# Altium schematic sheet Bluetooth_mersasV2.SchDoc
size A2
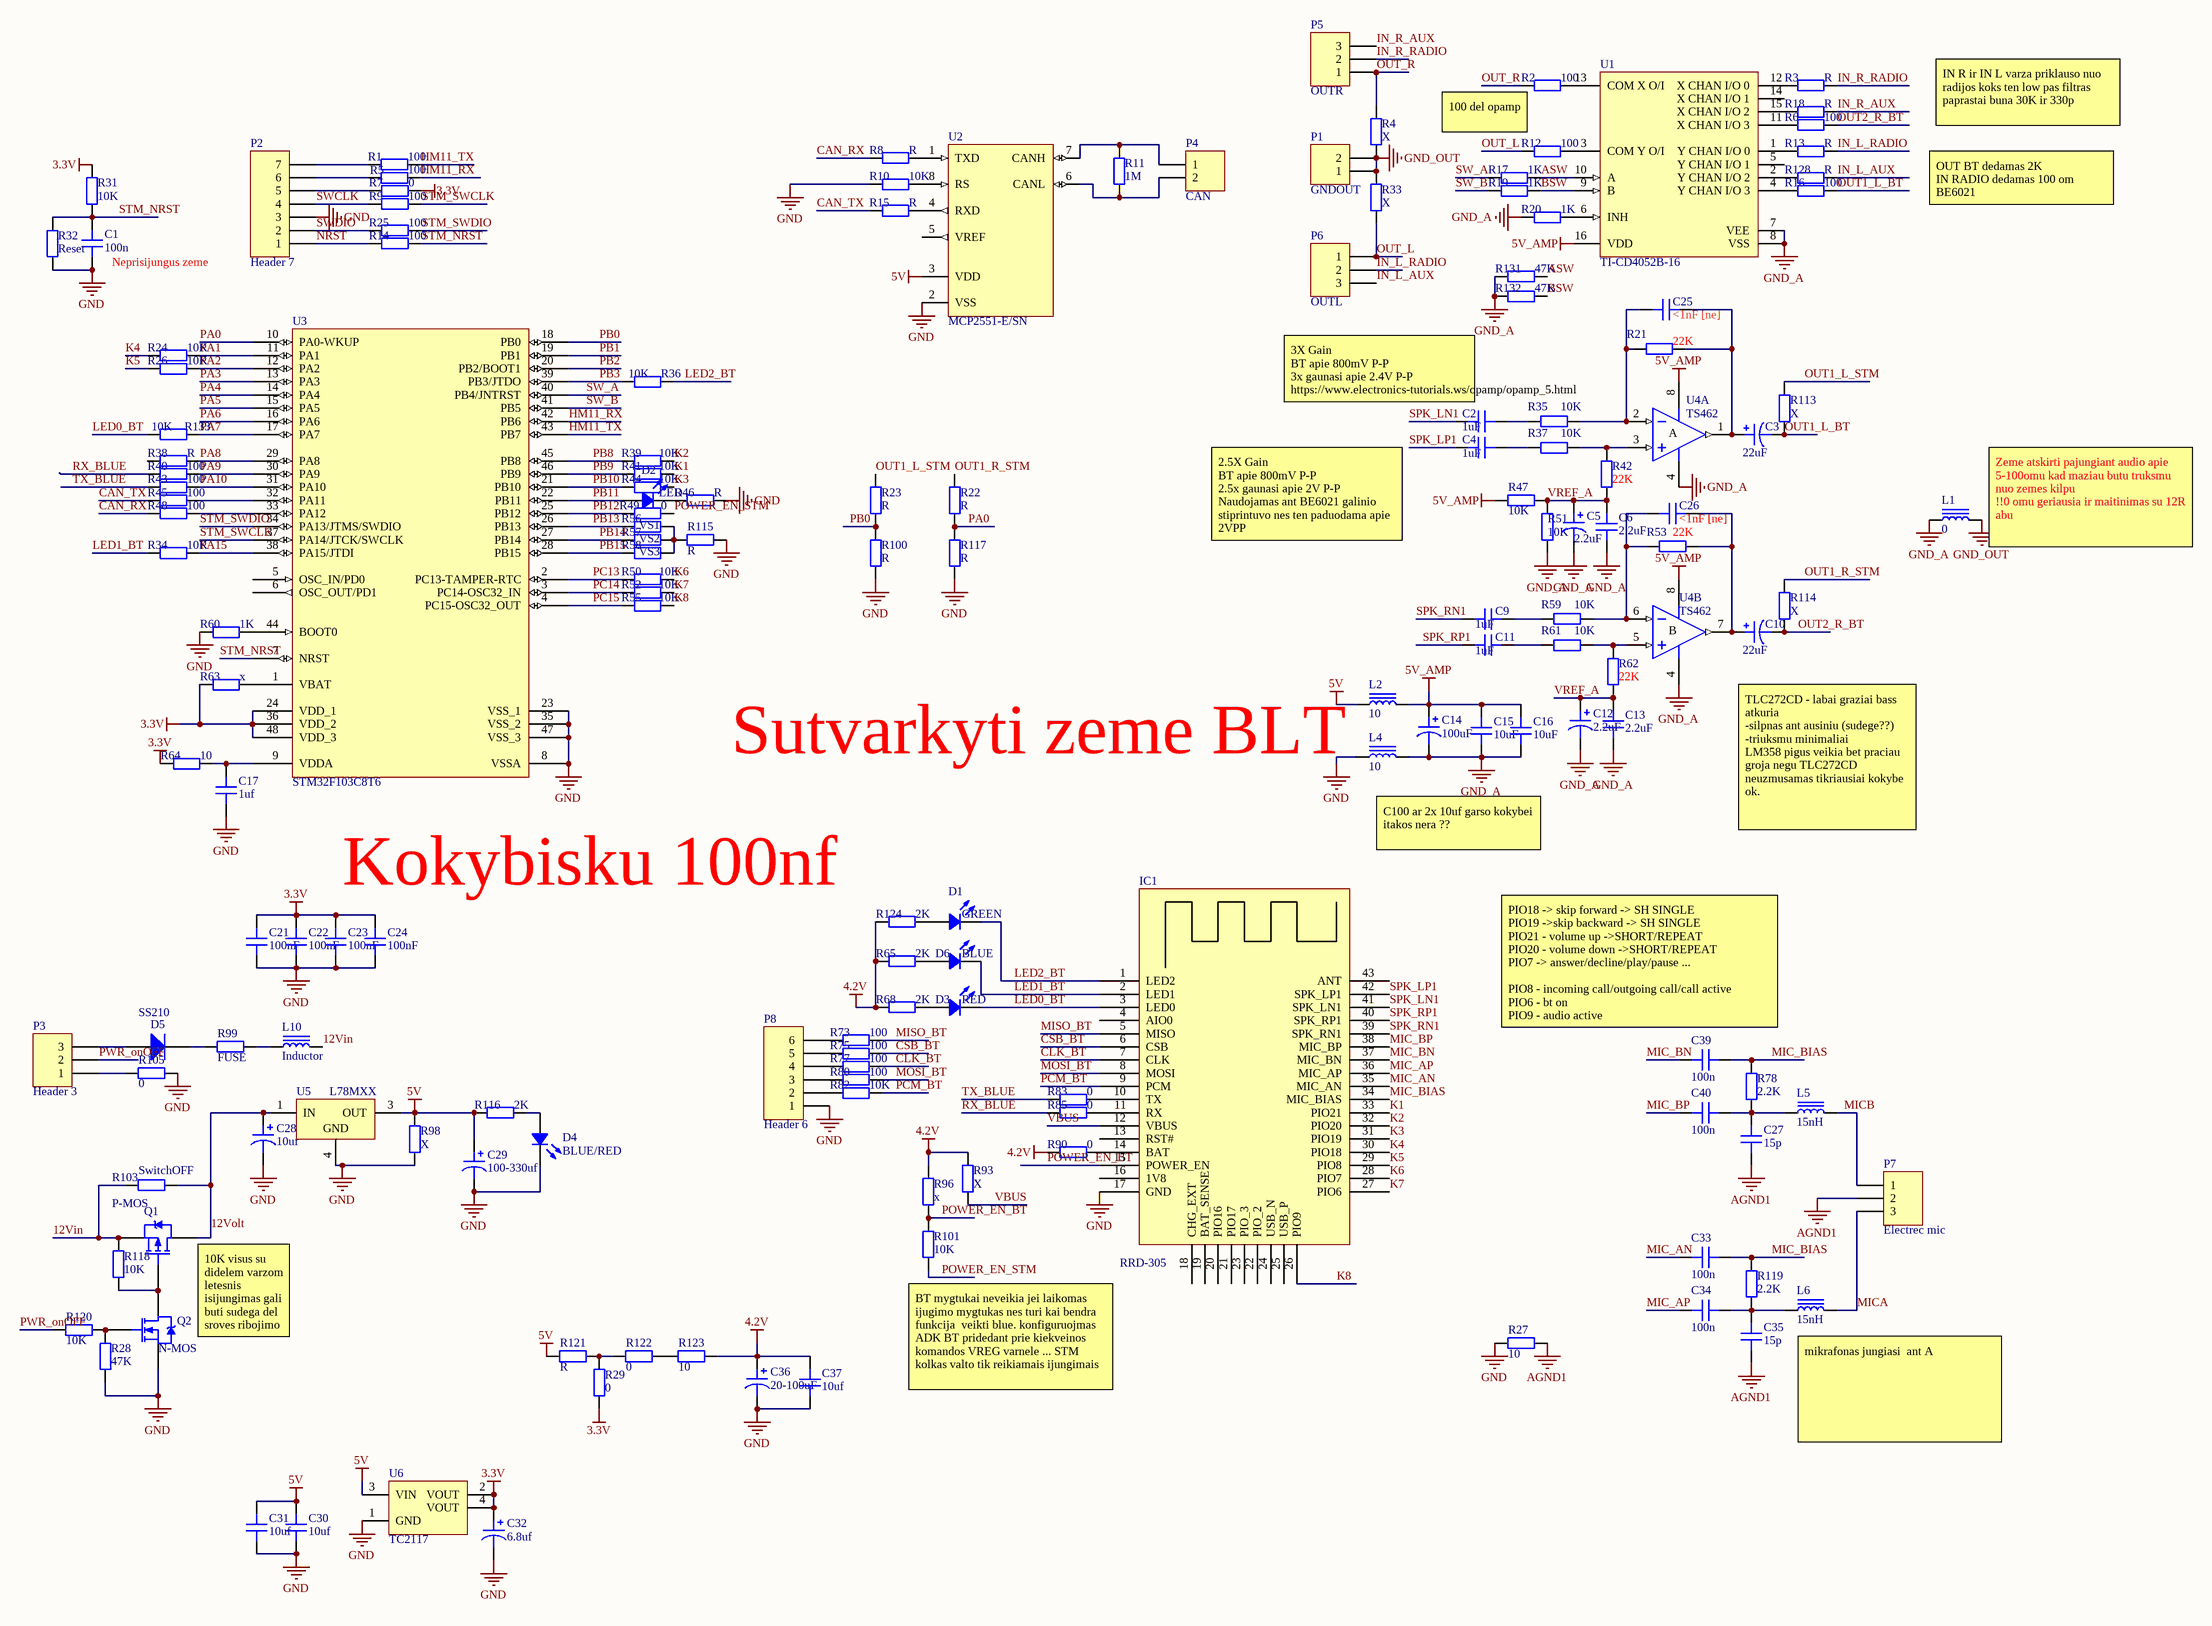
[diagram p0: Bluetooth_mersasV2.SchDoc]

## Parts
C1  100n  [CAP 0603/1608]
C2  1uF  [CAP 0805/2012]
C3  22uF  [TANT A size]
C4  1uF  [CAP 0805/2012]
C5  2.2uF  [TANT R(2824)]
C6  2.2uF  [CAP 0805/2012]
C9  1uF  [CAP 0805/2012]
C10  22uF  [TANT A size]
C11  1uF  [CAP 0805/2012]
C12  2.2uF  [TANT R(2824)]
C13  2.2uF  [CAP 0805/2012]
C14  100uF  [tant B size]
C15  10uF  [CAP 1206/3216]
C16  10uF  [CAP 1206/3216]
C17  1uf  [CAP 0805/2012]
C21  100nF  [CAP 0603/1608]
C22  100nF  [CAP 0603/1608]
C23  100nF  [CAP 0603/1608]
C24  100nF  [CAP 0603/1608]
C25  <1nF [ne]  [CAP 0805/2012]
C26  <1nF [ne]  [CAP 0805/2012]
C27  15p  [CAP 0603/1608]
C28  10uf  [CAP POL 2917/7343]
C29  100-330uf  [CAP POL 2917/7343]
C30  10uf  [CAP 1210/3225]
C31  10uf  [CAP 1210/3225]
C32  6.8uf  [CAP POL 2917/7343]
C33  100n  [CAP 0603/1608]
C34  100n  [CAP 0603/1608]
C35  15p  [CAP 0603/1608]
C36  20-100uF  [tant B size]
C37  10uf  [CAP 1206/3216]
C39  100n  [CAP 0603/1608]
C40  100n  [CAP 0603/1608]
D1  GREEN  [LED 0805/2012]
D2  LED  [LED 0603/1608]
D3  RED  [LED 0805/2012]
D4  BLUE/RED  [LED 0805/2012]
D5  SS210  [DO214AC SMA]
D6  BLUE  [LED 0805/2012]
IC1  RRD-305  [RRD-305]
L1  0  [IND 1206/3216 - 1.0MM]
L2  10  [IND 1206/3216 - 1.0MM]
L4  10  [IND 1206/3216 - 1.0MM]
L5  15nH  [IND 1206/3216 - 1.0MM]
L6  15nH  [IND 1206/3216 - 1.0MM]
L10  Inductor  [IND 1206/3216 - 1.0MM]
P1  GNDOUT  [HDR1X2]
P2  Header 7  [2mm1X7]
P3  Header 3  [HDR1X3]
P4  CAN  [HDR1X2]
P5  OUTR  [HDR1X3]
P6  OUTL  [HDR1X3]
P7  Electrec mic  [HDR1X3]
P8  Header 6  [2mm1X6]
Q1  P-MOS  [TI SOT-23-3 DBZ]
Q2  N-MOS  [TI SOT-23-3 DBZ]
R1  100  [RES 0603/1608]
R2  100  [RES 0805/2012]
R3  R  [RES 0805/2012]
R4  X  [RES 0805/2012]
R5  100  [RES 0603/1608]
R6  100  [RES 0805/2012]
R7  0  [RES 0603/1608]
R8  R  [RES 0805/2012]
R9  100  [RES 0603/1608]
R10  10K  [RES 0805/2012]
R11  1M  [RES 0603/1608]
R12  100  [RES 0805/2012]
R13  R  [RES 0805/2012]
R14  100  [RES 0603/1608]
R15  R  [RES 0603/1608]
R16  100  [RES 0805/2012]
R17  1K  [RES 0603/1608]
R18  R  [RES 0805/2012]
R19  1K  [RES 0603/1608]
R20  1K  [RES 0603/1608]
R21  22K  [RES 0805/2012]
R22  R  [RES 0603/1608]
R23  R  [RES 0603/1608]
R24  10K  [RES 0603/1608]
R25  100  [RES 0805/2012]
R26  10K  [RES 0603/1608]
R27  10  [RES 0805/2012]
R28  47K  [RES 0603/1608]
R29  0  [RES 1206/3216]
R31  10K  [RES 0603/1608]
R32  Reset  [RES 0805/2012]
R33  X  [RES 0805/2012]
R34  10K  [RES 0603/1608]
R35  10K  [RES 0805/2012]
R36  10K  [RES 0603/1608]
R37  10K  [RES 0805/2012]
R38  R  [RES 0603/1608]
R39  10K  [RES 0603/1608]
R40  100  [RES 0603/1608]
R41  10K  [RES 0603/1608]
R42  22K  [RES 0805/2012]
R43  100  [RES 0603/1608]
R44  10K  [RES 0603/1608]
R45  100  [RES 0603/1608]
R46  R  [RES 0603/1608]
R47  10K  [RES 0805/2012]
R48  100  [RES 0603/1608]
R49  0  [RES 0603/1608]
R50  10K  [RES 0603/1608]
R51  10K  [RES 0805/2012]
R52  10K  [RES 0603/1608]
R53  22K  [RES 0805/2012]
R55  10K  [RES 0603/1608]
R56  VS1  [RES 0603/1608]
R57  VS2  [RES 0603/1608]
R58  VS3  [RES 0603/1608]
R59  10K  [RES 0805/2012]
R60  1K  [RES 0603/1608]
R61  10K  [RES 0805/2012]
R62  22K  [RES 0805/2012]
R63  x  [RES 0603/1608]
R64  10  [RES 1206/3216]
R65  2K  [RES 0805/2012]
R68  2K  [RES 0805/2012]
R73  100  [RES 0603/1608]
R75  100  [RES 0603/1608]
R77  100  [RES 0603/1608]
R78  2.2K  [RES 0805/2012]
R80  100  [RES 0603/1608]
R82  10K  [RES 0603/1608]
R83  0  [RES 0603/1608]
R85  0  [RES 0603/1608]
R90  0  [RES 0603/1608]
R93  X  [RES 0603/1608]
R96  x  [RES 0603/1608]
R98  X  [RES 1206/3216]
R99  FUSE  [RES 1206/3216]
R100  R  [RES 0603/1608]
R101  10K  [RES 0603/1608]
R103  SwitchOFF  [RES 0805/2012]
R105  0  [RES 1206/3216]
R113  X  [RES 0603/1608]
R114  X  [RES 0603/1608]
R115  R  [RES 0603/1608]
R116  2K  [RES 0805/2012]
R117  R  [RES 0603/1608]
R118  10K  [RES 0603/1608]
R119  2.2K  [RES 0805/2012]
R120  10K  [RES 0805/2012]
R121  R  [RES 1206/3216]
R122  0  [RES 1206/3216]
R123  10  [RES 1206/3216]
R124  2K  [RES 0805/2012]
R128  R  [RES 0805/2012]
R131  47K  [RES 0603/1608]
R132  47K  [RES 0603/1608]
R133  10K  [RES 0603/1608]
U1  TI-CD4052B-16  [D0016A_N]
U2  MCP2551-E/SN  [SOIC-SN8_L]
U3  STM32F103C8T6  [NXP LQFP-48 7x7mm]
U4  TS462  [DIODES SO-8]  (parts A,B of 2)
U5  L78MXX  [TO-252]
U6  TC2117  [ST SOT-223]

## Nets
3.3V: C21.2 C22.2 C23.2 C24.2 C32.1 R7.1 R29.2 R31.2 R63.2 R64.2 U3.24(VDD_1) U3.36(VDD_2) U3.48(VDD_3) U6.2(VOUT) U6.4(VOUT)
4.2V: C36.1 C37.2 R65.2 R68.2 R90.2 R93.2 R96.1 R123.2 R124.2
5V: C29.1 C30.2 C31.2 L2.1 R98.1 R116.2 R121.1 U2.3(VDD) U5.3(OUT) U6.3(VIN)
5V_AMP: C14.1 C15.2 C16.2 L2.2 R47.1 U1.16(VDD) U4.8(V+)
AGND1: C27.1 C35.1 P7.2 R27.2
GND: C1.1 C17.1 C21.1 C22.1 C23.1 C24.1 C28.2 C29.2 C30.1 C31.1 C32.2 C36.2 C37.1 D4.2 IC1.17(GND) L4.1 P2.3 P8.1 Q2.2(S) R10.2 R27.1 R28.1 R32.1 R46.1 R60.2 R98.2 R100.2 R105.2 R115.2 R117.2 U2.2(VSS) U3.8(VSSA) U3.23(VSS_1) U3.35(VSS_2) U3.47(VSS_3) U5.4(GND) U6.1(GND)
GND_A: C5.2 C6.2 C12.2 C13.2 C14.2 C15.1 C16.1 L1.1 L4.2 R20.2 R51.1 R131.2 R132.2 U1.7(VEE) U1.8(VSS) U4.4(V-)
GND_OUT: L1.2 P1.1 P1.2 R4.2 R33.1
12Vin: L10.2 Q1.2(S) R103.1 R118.2
12Volt: C28.1 Q1.3(D) R103.2 U5.1(IN)
ASW: R17.1 R131.1 U1.10(A)
BSW: R19.1 R132.1 U1.9(B)
CAN_RX: R8.2 R48.2
CAN_TX: R15.2 R45.2
CLK_BT: IC1.7(CLK) R77.1
CSB_BT: IC1.6(CSB) R75.1
HM11_RX: R5.1 U3.42(PB6)
HM11_TX: R1.1 U3.43(PB7)
IN_L_AUX: P6.3 R128.1
IN_L_RADIO: P6.2 R13.1
IN_R_AUX: P5.3 R18.1
IN_R_RADIO: P5.2 R3.1
K1: IC1.33(PIO21) R41.1
K2: IC1.32(PIO20) R39.1
K3: IC1.31(PIO19) R44.1
K4: IC1.30(PIO18) R24.2
K5: IC1.29(PIO8) R26.2
K6: IC1.28(PIO7) R50.1
K7: IC1.27(PIO6) R52.1
K8: IC1.26(PIO9) R55.1
LED0_BT: D3.2 IC1.3(LED0) R133.2
LED1_BT: D6.2 IC1.2(LED1) R34.2
LED2_BT: D1.2 IC1.1(LED2) R36.2
MIC_AN: C33.2 IC1.35(MIC_AN)
MIC_AP: C34.2 IC1.36(MIC_AP)
MIC_BIAS: C33.1 C39.1 IC1.34(MIC_BIAS) R78.1 R119.1
MIC_BN: C39.2 IC1.37(MIC_BN)
MIC_BP: C40.2 IC1.38(MIC_BP)
MICA: L6.2 P7.3
MICB: L5.2 P7.1
MISO_BT: IC1.5(MISO) R73.1
MOSI_BT: IC1.8(MOSI) R80.1
NRST: P2.1 R14.2
OUT1_L_BT: C3.2 R16.1 R113.2
OUT1_L_STM: R23.1 R113.1
OUT1_R_STM: R22.1 R114.1
OUT2_R_BT: C10.2 R6.1 R114.2
OUT_L: P6.1 R12.2 R33.2
OUT_R: P5.1 R2.2 R4.1
PA0: R22.2 R117.1 U3.10(PA0-WKUP)
PA1: R24.1 U3.11(PA1)
PA2: R26.1 U3.12(PA2)
PA3: U3.13(PA3)
PA4: U3.14(PA4)
PA5: U3.15(PA5)
PA6: U3.16(PA6)
PA7: R133.1 U3.17(PA7)
PA8: R38.1 U3.29(PA8)
PA9: R40.1 U3.30(PA9)
PA10: R43.1 U3.31(PA10)
PA15: R34.1 U3.38(PA15/JTDI)
PB0: R23.2 R100.1 U3.18(PB0)
PB1: U3.19(PB1)
PB2: U3.20(PB2/BOOT1)
PB3: R36.1 U3.39(PB3/JTDO)
PB8: R39.2 U3.45(PB8)
PB9: R41.2 U3.46(PB9)
PB10: R44.2 U3.21(PB10)
PB11: D2.1 U3.22(PB11)
PB12: R49.2 U3.25(PB12)
PB13: R56.2 U3.26(PB13)
PB14: R57.2 U3.27(PB14)
PB15: R58.2 U3.28(PB15)
PC13: R50.2 U3.2(PC13-TAMPER-RTC)
PC14: R52.2 U3.3(PC14-OSC32_IN)
PC15: R55.2 U3.4(PC15-OSC32_OUT)
PCM_BT: IC1.9(PCM) R82.1
POWER_EN_BT: IC1.15(POWER_EN) R96.2 R101.1
POWER_EN_STM: R49.1 R101.2
PWR_onOFF: P3.2 R120.2
RX_BLUE: R40.2 R85.2
SPK_LN1: C2.2 IC1.41(SPK_LN1)
SPK_LP1: C4.2 IC1.42(SPK_LP1)
SPK_RN1: C9.2 IC1.39(SPK_RN1)
SPK_RP1: C11.2 IC1.40(SPK_RP1)
STM_NRST: C1.2 R14.1 R31.1 R32.2 U3.7(NRST)
STM_SWCLK: R9.1 U3.37(PA14/JTCK/SWCLK)
STM_SWDIO: R25.1 U3.34(PA13/JTMS/SWDIO)
SW_A: R17.2 U3.40(PB4/JNTRST)
SW_B: R19.2 U3.41(PB5)
SWCLK: P2.4 R9.2
SWDIO: P2.2 R25.2
TX_BLUE: R43.2 R83.2
VBUS: IC1.12(VBUS) R93.1
VREF_A: C5.1 C6.1 C12.1 C13.1 R42.2 R47.2 R51.2 R62.2
NetC2_1: C2.1 R35.2
NetC3_1: C3.1 C25.1 R21.1 U4.1(OUT)
NetC4_1: C4.1 R37.2
NetC9_1: C9.1 R59.2
NetC10_1: C10.1 C26.1 R53.1 U4.7(OUT)
NetC11_1: C11.1 R61.2
NetC17_2: C17.2 R64.1 U3.9(VDDA)
NetC25_2: C25.2 R21.2 R35.1 U4.2(IN-)
NetC26_2: C26.2 R53.2 R59.1 U4.6(IN-)
NetC27_2: C27.2 C40.1 L5.1 R78.2
NetC34_1: C34.1 C35.2 L6.1 R119.2
NetD1_1: D1.1 R124.1
NetD2_2: D2.2 R46.2
NetD3_1: D3.1 R68.1
NetD4_1: D4.1 R116.1
NetD5_1: D5.1(A) P3.3
NetD5_2: D5.2(K) R99.1
NetD6_1: D6.1 R65.1
NetIC1_10: IC1.10(TX) R83.1
NetIC1_11: IC1.11(RX) R85.1
NetIC1_14: IC1.14(BAT) R90.1
NetL10_1: L10.1 R99.2
NetP2_5: P2.5 R7.2
NetP2_6: P2.6 R5.2
NetP2_7: P2.7 R1.2
NetP3_1: P3.1 R105.1
NetP4_1: P4.1 R11.1 U2.7(CANH)
NetP4_2: P4.2 R11.2 U2.6(CANL)
NetP8_2: P8.2 R82.2
NetP8_3: P8.3 R80.2
NetP8_4: P8.4 R77.2
NetP8_5: P8.5 R75.2
NetP8_6: P8.6 R73.2
NetQ1_1: Q1.1(G) Q2.3(D) R118.1
NetQ2_1: Q2.1(G) R28.2 R120.1
NetR2_1: R2.1 U1.13(COM_X_O/I)
NetR3_2: R3.2 U1.12(X_CHAN_I/O_0)
NetR6_2: R6.2 U1.11(X_CHAN_I/O_3)
NetR8_1: R8.1 U2.1(TXD)
NetR10_1: R10.1 U2.8(RS)
NetR12_1: R12.1 U1.3(COM_Y_O/I)
NetR13_2: R13.2 U1.1(Y_CHAN_I/O_0)
NetR15_1: R15.1 U2.4(RXD)
NetR16_2: R16.2 U1.4(Y_CHAN_I/O_3)
NetR18_2: R18.2 U1.15(X_CHAN_I/O_2)
NetR20_1: R20.1 U1.6(INH)
NetR29_1: R29.1 R121.2 R122.1
NetR37_1: R37.1 R42.1 U4.3(IN+)
NetR45_1: R45.1 U3.32(PA11)
NetR48_1: R48.1 U3.33(PA12)
NetR56_1: R56.1 R57.1 R58.1 R115.1
NetR60_1: R60.1 U3.44(BOOT0)
NetR61_1: R61.1 R62.1 U4.5(IN+)
NetR63_1: R63.1 U3.1(VBAT)
NetR122_2: R122.2 R123.1
NetR128_2: R128.2 U1.2(Y_CHAN_I/O_2)

Not connected (* = marked no-connect by the designer): IC1 4(AIO0) 13(RST#) 16(1V8) 18(CHG_EXT) 19(BAT_SENSE) 20(PIO16) 21(PIO17) 22(PIO_2) 23(PIO_3) 24(USB_N) 25(USB_P) 43(ANT); R38 2; U1 5(Y_CHAN_I/O_1) 14(X_CHAN_I/O_1); U2 5(VREF); U3 5(OSC_IN/PD0) 6(OSC_OUT/PD1)

## Notes on the sheet
- (near R2) 100 del opamp
- IN R ir IN L varza priklauso nuo radijos koks ten low pas filtras paprastai buna 30K ir 330p
- OUT BT dedamas 2K
  IN RADIO dedamas 100 om
  BE6021
- (near C2) 3X Gain
  BT apie 800mV P-P
  3x gaunasi apie 2.4V P-P https://www.electronics-tutorials.ws/opamp/opamp_5.html
- (near R113) Isejimo kondikas priklauso nuo load jei ausinemes su 32Omu high pass filtrui kad atkurtu zemus daznius reikia nemazo kondiko apie 220uF
- 2.5X Gain
  BT apie 800mV P-P
  2.5x gaunasi apie 2V P-P
  Naudojamas ant BE6021 galinio stiprintuvo nes ten paduodama apie 2VPP
- (near L1) Zeme atskirti pajungiant audio apie 5-100omu kad maziau butu truksmu nuo zemes kilpu
  !!0 omu geriausia ir maitinimas su 12R abu
- C100 ar 2x 10uf garso kokybei itakos nera ??
- TLC272CD - labai graziai bass atkuria
  -silpnas ant ausiniu (sudege??)
  -triuksmu minimaliai
  LM358 pigus veikia bet praciau groja negu TLC272CD neuzmusamas tikriausiai kokybe ok.
- PIO18 -> skip forward -> SH SINGLE
  PIO19 ->skip backward -> SH SINGLE
  PIO21 - volume up ->SHORT/REPEAT
  PIO20 - volume down ->SHORT/REPEAT
  PIO7 -> answer/decline/play/pause ...
  PIO8 - incoming call/outgoing call/call active
  PIO6 - bt on
  PIO9 - audio active
- 10K visus su didelem varzom letesnis isijungimas gali buti sudega del sroves ribojimo ijungti is karto
- (near R101) BT mygtukai neveikia jei laikomas ijugimo mygtukas nes turi kai bendra funkcija  veikti blue. konfiguruojmas ADK BT pridedant prie kiekveinos komandos VREG varnele ... STM kolkas valto tik reikiamais ijungimais
- (near L6) mikrafonas jungiasi  ant A
- Labels drawn without touching a wire or pin: Kokybisku 100nf, Neprisijungus zeme, Sutvarkyti zeme BLT
- (in symbol TS462, part A) A
- (in symbol TS462, part B) B

## Library data of the parts
C1 C2 C4 C6 C9 C11 C13 C15-C17 C21-C27 C30 C31 C33-C35 C37 C39 C40 = C: Ceramic capacitor
C3 C5 C10 C12 C14 C28 C29 C32 C36 = Cpola: Polarised Capacitor
D1-D4 D6 = LED: Chip LED
D5 = Diode
IC1 = RRD-305: Audio Module Bluetooth 5.0 QCC3005 chip
L1 L2 L4-L6 L10 = Inductor: SMT Inductor
P1 P4 = Header 2: Header, 2-Pin; LatestRevisionDate: 17-Jul-2002; LatestRevisionNote: Re-released for DXP Platform.; Publisher: Altium Limited
P2 = Header 7: Header, 7-Pin; LatestRevisionDate: 17-Jul-2002; LatestRevisionNote: Re-released for DXP Platform.; Publisher: Altium Limited
P3 P5-P7 = Header 3: Header, 3-Pin; LatestRevisionDate: 17-Jul-2002; LatestRevisionNote: Re-released for DXP Platform.; Publisher: Altium Limited
P8 = Header 6: Header, 6-Pin; LatestRevisionDate: 17-Jul-2002; LatestRevisionNote: Re-released for DXP Platform.; Publisher: Altium Limited
Q1 = Mosfet-Pch SOT23: Power MOSFET 1GAte 2Source 3 DRAIN; Published: 8-Jun-2000; LatestRevisionDate: 20-Nov-2009; LatestRevisionNote: IPC-7351 Footprint Added.; DatasheetVersion: Aug-1997; PackageReference: SOT-23; Publisher: Altium Limited; PackageDescription: 3-Pin SOT-23 Package 0.95 mm Pitch, 2.3 mm Lead Span; ComponentLink1Description: Manufacturer Link; ComponentLink1URL: http://www.irf.com/; ComponentLink2Description: Datasheet; ComponentLink2URL: http://www.irf.com/product-info/datasheets/data/irlml6302.pdf
Q2 = Mosfet-Nch SOT23: Power MOSFET 1GAte 2Source 3 DRAIN; Published: 8-Jun-2000; LatestRevisionDate: 20-Nov-2009; LatestRevisionNote: IPC-7351 Footprint Added.; DatasheetVersion: Aug-1997; PackageReference: SOT-23; Publisher: Altium Limited; PackageDescription: 3-Pin SOT-23 Package 0.95 mm Pitch, 2.3 mm Lead Span; ComponentLink1Description: Manufacturer Link; ComponentLink1URL: http://www.irf.com/; ComponentLink2Description: Datasheet; ComponentLink2URL: http://www.irf.com/product-info/datasheets/data/irlml2402.pdf
R1-R29 R31-R53 R55-R65 R68 R73 R75 R77 R78 R80 R82 R83 R85 R90 R93 R96 R98-R101 R103 R105 R113-R124 R128 R131-R133 = R: Resistor
U2 = MCP2551-E/SN: High-Speed CAN Transceiver, 8-Pin SOIC, Extended Temperature; Manufacturer: Microchip; DatasheetVersion: revF, Jul-2010; PackageVersion: revBB, Aug-2009; PackageReference: SOIC-SN8; PackageDescription: 8-Lead Plastic Small Outline (SN) - Narrow, 3.90mm Body [SOIC]; Supplier 1: Digi-Key; Supplier Part Number 1: MCP2551-E/SN-ND; Supplier 2: Farnell; Supplier Part Number 2: 1467746; Supplier 3: Newark; Supplier Part Number 3: 92C4186; Supplier 4: Mouser; Supplier Part Number 4: 579-MCP2551-E/SN; Mounting Technology: Surface Mount; Code_JEDEC: MS-012; Code_IPC: SOIC127P600-8; PartNumber: MCP2551-E/SN; ComponentLink1Description: Manufacturer URL; ComponentLink1URL: http://www.microchip.com/; ComponentLink2Description: Datasheet; ComponentLink2URL: http://ww1.microchip.com/downloads/en/DeviceDoc/21667F.pdf; ComponentLink3Description: Package Specification; ComponentLink3URL: http://www.microchip.com/stellent/groups/techpub_sg/documents/packagingspec/en012702.pdf
U3 = STM32F103C8T6: STM32 ARM-based 32-bit MCU with 64 Kbytes Flash, 48-pin LQFP, Industrial Temperature; Published: 30-May-2008; DatasheetVersion: rev6, Mar-2008; PackageVersion: Mar-2008; PackageReference: LQFP48; Publisher: Altium Limited; PackageDescription: 48-Pin Low-Profile Quad Flat Pack, 7 x 7 mm Body, 0.5 mm Pitch (LQFP48); ComponentLink1Description: Manufacturer Link; ComponentLink1URL: www.st.com/stm32; ComponentLink2Description: Datasheet; ComponentLink2URL: http://www.st.com/stonline/products/literature/ds/13587.pdf
U4 = TS462: Low-Noise Dual Operational Amplifier; Published: 24-Aug-2001; LatestRevisionDate: 13-Apr-2006; LatestRevisionNote: IPC-7351 Footprint Added.; DatasheetVersion: Nov-1996; PackageVersion: Dec-2002; PackageReference: SO8; Publisher: Altium Limited; PackageDescription: 8-Pin Small Outline Integrated Circuit 1.27 mm Pitch; Code_JEDEC: MS-012-AA; Code_IPC: SOIC127P600-8; ComponentLink1Description: Manufacturer Link; ComponentLink1URL: https://www.st.com/resource/en/datasheet/ts462.pdf
U5 = L78MXX: Positive Voltage Regulator; Published: 24-Aug-2001; LatestRevisionDate: 06-Jun-2005; LatestRevisionNote: PCB pads lengthened.; DatasheetVersion: Apr-1994; PackageVersion: Jun-2004; PackageReference: TO-252; Publisher: Altium Limited; PackageDescription: D-PAK/TO-252-AA; 3 Leads (1 Cropped); Body 10.1 (inc. leads) x 6.6 mm (LxW max); ComponentLink1Description: Manufacturer Link; ComponentLink1URL: http://www.st.com/; ComponentLink2Description: Datasheet; ComponentLink2URL: http://www.st.com/stonline/products/literature/ds/2146/l78m05c.pdf